# EAGLE design GPS (EAGLE 5.10)
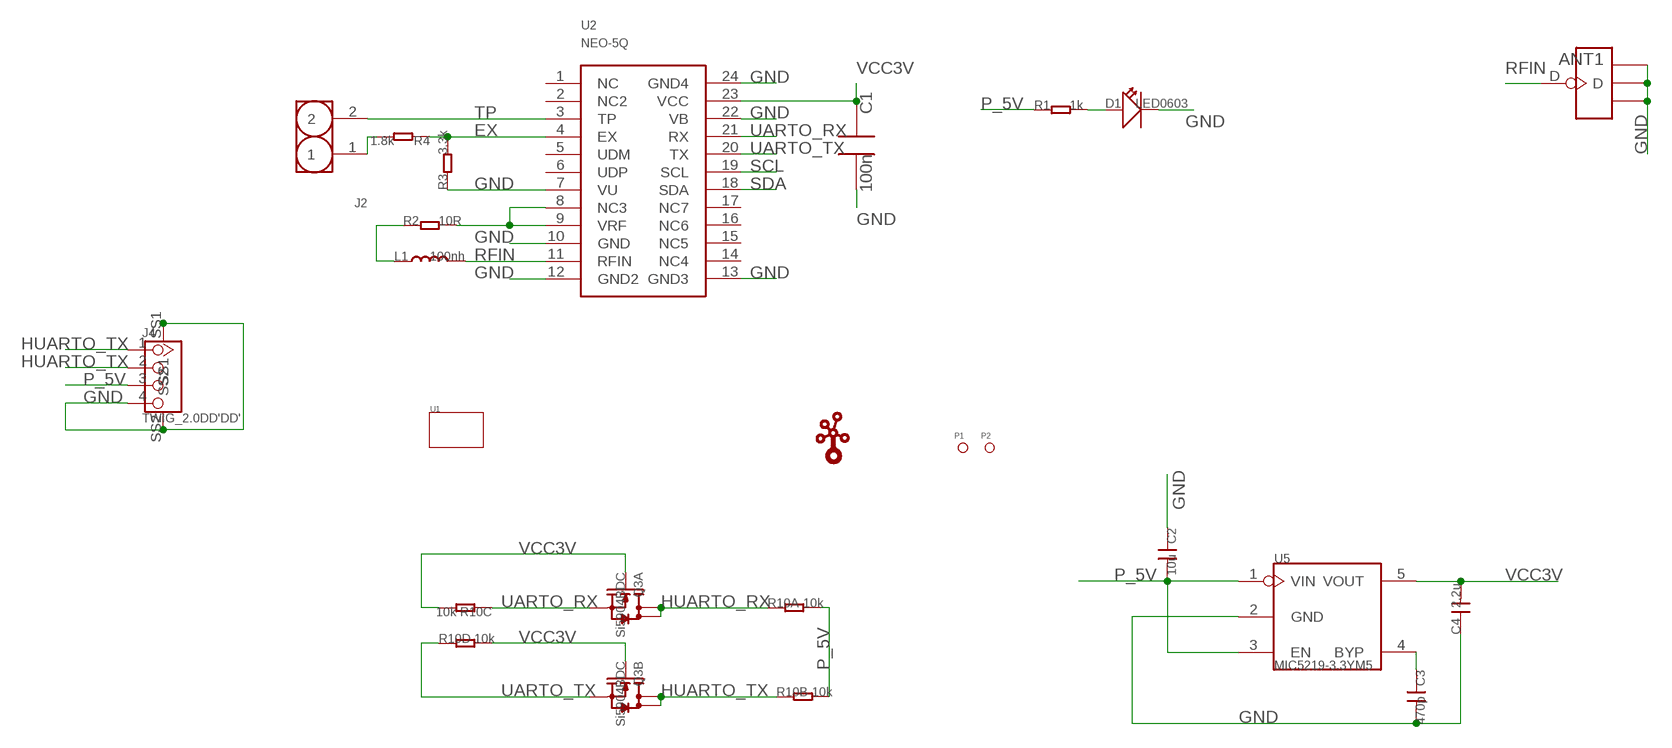
[diagram p0: schematic, sheet 1]

## Parts
ANT1  ANTENNA-U-FL  [4P-U-FL]
C1  100n  C0603  [0603]
C2  10u  C-0805  [0805]
C3  470p  C-0603  [0603]
C4  2.2u  C-0805  [0805]
D1  LED0603  [LED0603]
J2  HEADER-2P-2.54  [2P-2.54-LEADED]
J4  TWIG_2.0DD'DD'  [2.0_1X4DD]
L1  100nh  L0603  [0603]
P1  PAD-MARK  [ROUND-MARK-0.635]
P2  PAD-MARK  [ROUND-MARK-0.635]
Q3  Si5904BDC  010-DUAL-N-MOSFET_1206-8  [1206-8]
R1  1k  R-0603  [0603]
R2  10R  R-0603  [0603]
R3  3.3k  R-0603  [0603]
R4  1.8k  R-0603  [0603]
R10  10k  005-4R_1206  [R1206-8]
U1  TWIG-2U  [2U-DIM-W/-DRILL]
U2  NEO-5Q  [NEO-5Q]
U5  MIC5219-3.3YM5  MIC5025-SOT23-5  [SOT23-5]
U$1  LOGO-TWIG  [TWIGLOGO]

## Nets
EX: R3.2 R4.1 U2.4(EX)
GND: ANT1.GND1 ANT1.GND2 ANT1.GND3 C1.2 C2.1 C3.2 C4.1 D1.2(-) J4.4 J4.SS1 J4.SS2 R3.1 U2.7(VU) U2.10(GND) U2.12(GND2) U2.13(GND3) U2.22(VB) U2.24(GND4) U5.2(GND)
HUARTO_RX: J4.2 Q3.7(A:D) Q3.8(A:D) R10.1
HUARTO_TX: J4.1 Q3.5(B:D) Q3.6(B:D) R10.2
N$1: D1.1(+) R1.2
N$4: J2.1 R4.2
N$5: L1.1 R2.1
N$8: R2.2 U2.8(NC3) U2.9(VRF)
N$18: C3.1 U5.4(BYP)
P_5V: C2.2 J4.3 R1.1 R10.7 R10.8 U5.1(VIN) U5.3(EN)
RFIN: ANT1.D L1.2 U2.11(RFIN)
SCL: U2.19(SCL)
SDA: U2.18(SDA)
TP: J2.2 U2.3(TP)
UARTO_RX: Q3.1(A:S) R10.3 U2.21(RX)
UARTO_TX: Q3.3(B:S) R10.4 U2.20(TX)
VCC3V: C1.1 C4.2 Q3.2(A:G) Q3.4(B:G) R10.5 R10.6 U2.23(VCC) U5.5(VOUT)
Unconnected: U2.1(NC) U2.2(NC2) U2.5(UDM) U2.6(UDP) U2.14(NC4) U2.15(NC5) U2.16(NC6) U2.17(NC7)

## Library data of the parts
ANT1 = Connector:ANTENNA-U-FL
C1 = CPT_SMD:C0603; C0603: 100N
C2-C4 = Discreter:C*: Ceramic Capacitors
D1 = CPT_SMD:LED0603
J2 = Connector:HEADER-2P
J4 = CONNECTER:TWIG_2.0DD
L1 = Discrete:L*
P1 P2 = Discrete:PAD-MARK
Q3 = Discrete:010-DUAL-N-MOSFET*: Si5902BDC Si5904DC Si5908DC Si5920DC
R1-R4 = Discrete:R*
R10 = Discrete:005-4R*: Resistor Array
U1 = Module:TWIG
U2 = Seeed:NEO-5Q
U5 = IC:MIC5025
U$1 = Logo:LOGO-TWIG

## Net classes
0 default: width 0.152 mm, drill 0.152 mm, clearance 0.152 mm

## Board
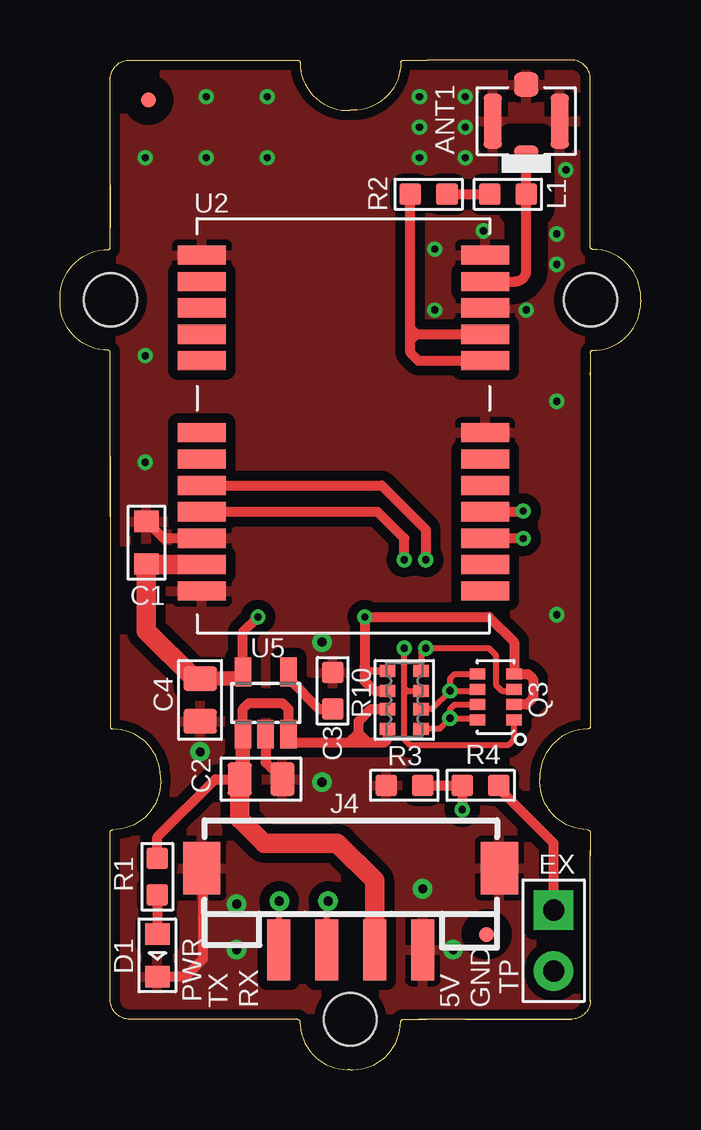
[diagram p1: board, top side]
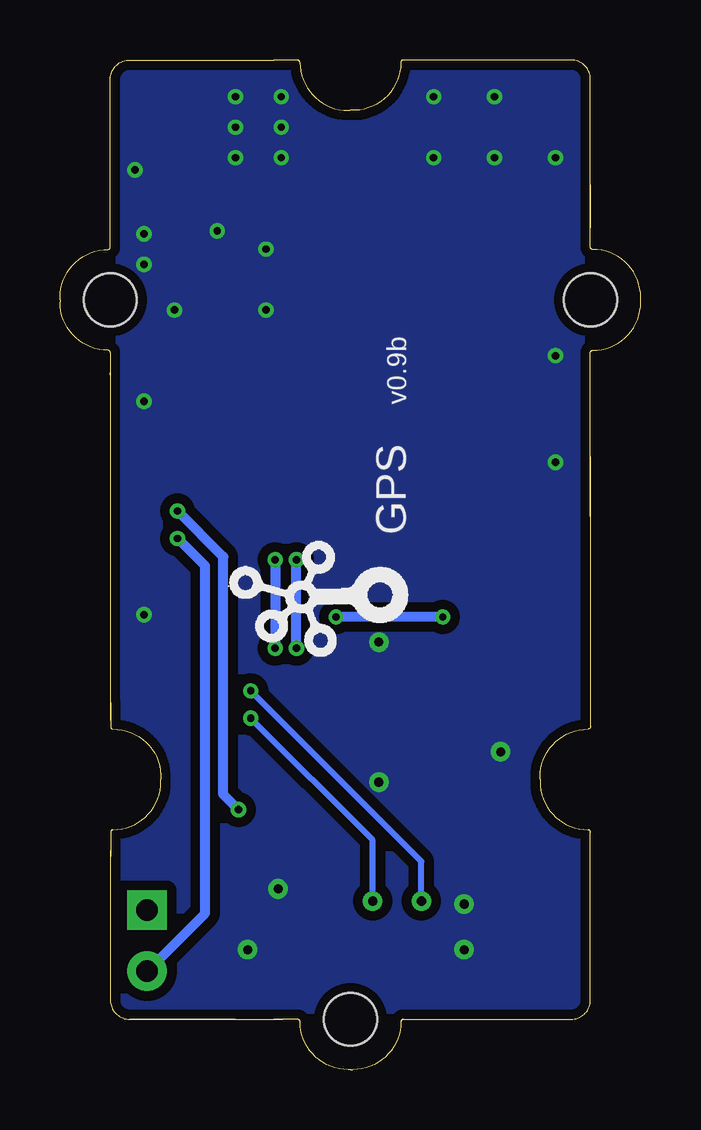
[diagram p2: board, bottom side, seen from below]

Size 24.2 x 42.09 mm. Coordinates in mm from the lower left corner, seen from the top.
Copper layers (1*16): Top 0.035mm / dielectric 1.5mm / Bottom 0.035mm
Design rules "SeeedStudio_rule_no_angle_090911 *": minimum track width 6mil, minimum drill 12mil, track to track 6mil, track to pad 6mil, pad to pad 6mil, via to via 6mil, smd to smd 0mil, copper to edge 10mil, drill to drill 10mil, minimum pad ring 10mil, minimum via ring 6mil, stop-mask expansion 2mil, vias tented up to drill 100mil, thermal gap 10mil
tRestrict: 13 lines

### Footprints (pad centres in the part's own frame; a part is rotated, then mirrored left to right if it is on the bottom)
4P-U-FL = smd 1.016 x 1.016: D -1.524,0; GND3 1.524,0 | smd 2.286 x 0.762: GND1 0,1.397; GND2 0,-1.397
0603 = smd 0.889 x 1.016: 1 -0.889,0; 2 0.889,0
0805 = smd 1.016 x 1.397: 1 -0.889,0; 2 0.889,0
0603' = smd 0.889 x 0.889: 1 -0.762,0; 2 0.762,0
LED0603 = smd 0.889 x 1.016: 1 -0.889,0; 2 0.889,0
2P-2.54-LEADED = drill 0.889 pad 1.651 square: 1 0,1.27 | drill 0.889 pad 1.651 round: 2 0,-1.27
2.0_1X4DD = smd 0.965 x 2.54: 1 -3,0; 2 -1,0; 3 1,0; 4 3,0 | smd 1.55 x 2.184: SS1 -6.2,3.4; SS2 6.2,3.4
ROUND-MARK-0.635 = smd 0.635 x 0.635: P$1 0,0
1206-8 = smd 0.457 x 0.635: 1 -0.953,-0.762; 2 -0.318,-0.762; 3 0.318,-0.762; 4 0.953,-0.762; 5 0.953,0.762; 6 0.318,0.762; 7 -0.318,0.762; 8 -0.953,0.762
R1206-8 = smd 0.508 x 0.635: 1 -1.206,-0.699; 2 -0.381,-0.699; 3 0.381,-0.699; 4 1.206,-0.699; 5 1.206,0.699; 6 0.381,0.699; 7 -0.381,0.699; 8 -1.206,0.699
2U-DIM-W/-DRILL = hole 2.2: 10.453,-10.42; 10.453,9.58; -19.535,-0.415
NEO-5Q = smd 2 x 0.8: 1 12,-14; 2 12,-12.9; 3 12,-11.8; 4 12,-10.7; 5 12,-9.6; 6 12,-8.5; 7 12,-7.4; 8 12,-4.4; 9 12,-3.3; 10 12,-2.2; 11 12,-1.1; 12 12,0; 13 0.2,0; 14 0.2,-1.1; 15 0.2,-2.2; 16 0.2,-3.3; 17 0.2,-4.4; 18 0.2,-7.4; 19 0.2,-8.5; 20 0.2,-9.6; 21 0.2,-10.7; 22 0.2,-11.8; 23 0.2,-12.9; 24 0.2,-14
SOT23-5 = smd 0.69 x 1.2: 1 -0.95,-1.3; 2 0,-1.3; 3 0.95,-1.3; 4 0.95,1.3; 5 -0.95,1.3

### Placement (x,y rotation side)
ANT1  19.43,39.54 90 top
C1  3.6,21.97 90 top
C2  8.38,12.11 180 top
C3  470p  [0603']  11.36,15.79 90 top
C4  5.84,15.41 90 top
D1  4.06,4.77 270 top
J2  20.57,5.38 0 top
J4  12.11,5 0 top
L1  100nh  [0603']  18.66,36.49 0 top
P1  3.68,40.43 0 top
P2  17.78,5.63 0 top
Q3  18.16,15.54 90 top
R1  1k  [0603']  4.06,8.05 270 top
R2  10R  [0603']  15.36,36.49 180 top
R3  3.3k  [0603']  14.35,11.86 0 top
R4  1.8k  [0603']  17.52,11.86 0 top
R10  14.35,15.41 90 top
U1  11.68,21.64 90 top
U2  5.71,33.95 0 top
U5  8.57,15.29 0 top
U$1  10.66,19.73 90 bottom

### Tracks (layer width: path | path; a pad name or v marks a point on that pad's centre or on a via)
EX  (via drill 0.3 pad 0.64)
  Top 0.406: R3.2 R4.1 v16.76,10.84 | U2.4 19.27,23.25 v19.3,23.29
  Bottom 0.406: v19.3,23.29 17.39,21.38 17.39,11.48 v16.76,10.84
GND  (via drill 0.3 pad 0.64, 0.38 pad 0.81)
  Top 0.406: U5.2 8.57,12.81 C2.1 | U2.22 4.3,22.15 C1.2 | D1.2 5.23,3.88 5.96,4.62 5.96,8.35 J4.SS1
  other vias: 16.89,40.56 16.89,39.29 16.89,38.02 21.08,37.51 20.7,34.84 20.7,33.57 19.43,31.67 15.62,31.67 15.62,34.21 17.65,34.97 14.98,40.56 14.98,39.29 14.98,38.02 7.36,5 16.38,5 10.92,17.83 10.92,11.98 5.84,13.25 8.63,40.56 6.09,40.56 6.09,38.02 8.63,38.02 3.55,25.32 3.55,29.76 3.55,38.02 20.7,18.97 20.7,27.86 15.11,7.54 7.36,6.9
  pour Bottom (isolate 0.406): -0.26,42.46 24.51,42.46 24.51,-0.72 -1.53,-0.72 -1.53,42.46
  pour Top (isolate 0.406): -1.53,42.46 24.51,42.46 24.51,-0.72 -1.53,-0.72
HUARTO_RX  (via drill 0.3 pad 0.64, 0.38 pad 0.81)
  Top 0.254: Q3.8 17.33,14.65 v16.25,14.65 | R10.1 15.81,14.21 v16.25,14.65 | Q3.7 16.44,15.22 16.25,15.03 v16.25,14.65 | J4.2 11.11,6.97 v11.17,7.03
  Bottom 0.254: v11.17,7.03 11.17,9.35 11.17,9.57 v16.25,14.65
HUARTO_TX  (via drill 0.3 pad 0.64, 0.38 pad 0.81)
  Top 0.254: Q3.6 17.33,15.79 v16.25,15.79 | R10.2 15.49,15.03 v16.25,15.79 | Q3.5 16.44,16.49 16.25,16.3 v16.25,15.79 | v9.14,7.03 9.14,5.03 J4.1
  Bottom 0.254: v16.25,15.79 9.14,8.68 v9.14,7.03
N$1
  Top 0.406: R1.2 D1.1
N$4
  Top 0.406: R4.2 18.28,11.73 20.57,9.44 J2.1
N$5
  Top 0.406: R2.1 L1.1
N$8
  Top 0.406: 14.6,30.4 14.6,30.91 | 14.6,30.4 14.6,29.88 14.93,29.55 U2.8 | 14.6,30.91 R2.2 | U2.9 14.85,30.65 14.6,30.91 | 14.6,30.4 14.85,30.65
N$18
  Top 0.406: C3.1 10.79,15.03 9.52,16.3 U5.4
P_5V
  Top 0.406: U5.1 7.62,15.03 7.87,15.29 9.27,15.29 9.52,15.03 U5.3 9.52,13.64 9.52,13.63 12.06,13.63 | 12.06,13.63 12.44,13.63 | 12.44,13.63 12.82,13.63 | R10.7 12.95,15.03 12.44,14.52 12.44,14.02 | 12.44,13.63 12.44,14.02 | 12.06,13.63 12.44,14.02 | 12.44,14.02 12.82,13.63 | 12.82,13.63 13.51,13.63 13.65,13.78 R10.8 | R1.1 4.06,9.7 6.47,12.11 C2.2
  Top 0.61: U5.1 7.62,12.24 C2.2
  Top 0.813: J4.3 13.11,7.88 11.55,9.44 8.5,9.44 7.49,10.46 C2.2
RFIN
  Top 0.406: U2.11 18.96,32.85 arc90 19.43,33.32 L1.2 ANT1.D
TP  (via drill 0.3 pad 0.64)
  Top 0.406: v19.3,22.14 U2.3
  Bottom 0.406: v19.3,22.14 18.16,21 18.16,6.52 J2.2
UARTO_RX  (via drill 0.3 pad 0.64)
  Top 0.254: Q3.1 18.92,13.76 18.7,13.54 14.57,13.54 14.35,13.76 14.35,15.67 | 14.35,15.67 14.47,15.79 | 14.47,15.79 R10.3 | 14.35,15.67 14.35,15.92 | 14.35,15.92 v14.35,17.57 | 14.47,15.79 14.35,15.92
  Top 0.406: U2.21 13.24,23.25 14.35,22.14 v14.35,21.25
  Bottom 0.254: v14.35,17.57 14.35,20.24
  Bottom 0.406: v14.35,17.57 v14.35,21.25
UARTO_TX  (via drill 0.3 pad 0.64)
  Top 0.254: Q3.3 18.85,15.79 18.41,15.79 18.16,16.05 18.16,17.29 17.87,17.57 v15.24,17.57 15.04,17.38 R10.4
  Top 0.406: U2.20 13.41,24.35 15.24,22.52 v15.24,21.25
  Bottom 0.406: v15.24,21.25 v15.24,17.57
VCC3V  (via drill 0.3 pad 0.61)
  Top 0.305: 12.7,16.43 12.89,16.62 | 12.89,16.62 R10.5 | 12.7,16.81 12.89,16.62
  Top 0.406: R10.6 13.1,15.79 12.7,16.2 12.7,16.43 12.7,16.81 v12.7,18.87 17.87,18.87 18.92,17.83 Q3.4 19.51,16.49 19.72,16.28 19.72,15.5 19.44,15.22 Q3.2 | v8.25,18.87 7.62,18.24 U5.5
  Top 0.61: U5.5 7.62,16.3 C4.2
  Top 0.813: U2.23 3.62,21.05 C1.1 3.6,18.28 5.58,16.3 C4.2
  Bottom 0.406: v8.25,18.87 v12.7,18.87

### Text on the board
tPlace: EX | PWR | TP | TX | RX | 5V | GND
bPlace: v0.9b | GPS